# EAGLE design pihat-v1 (EAGLE 8.7.1)
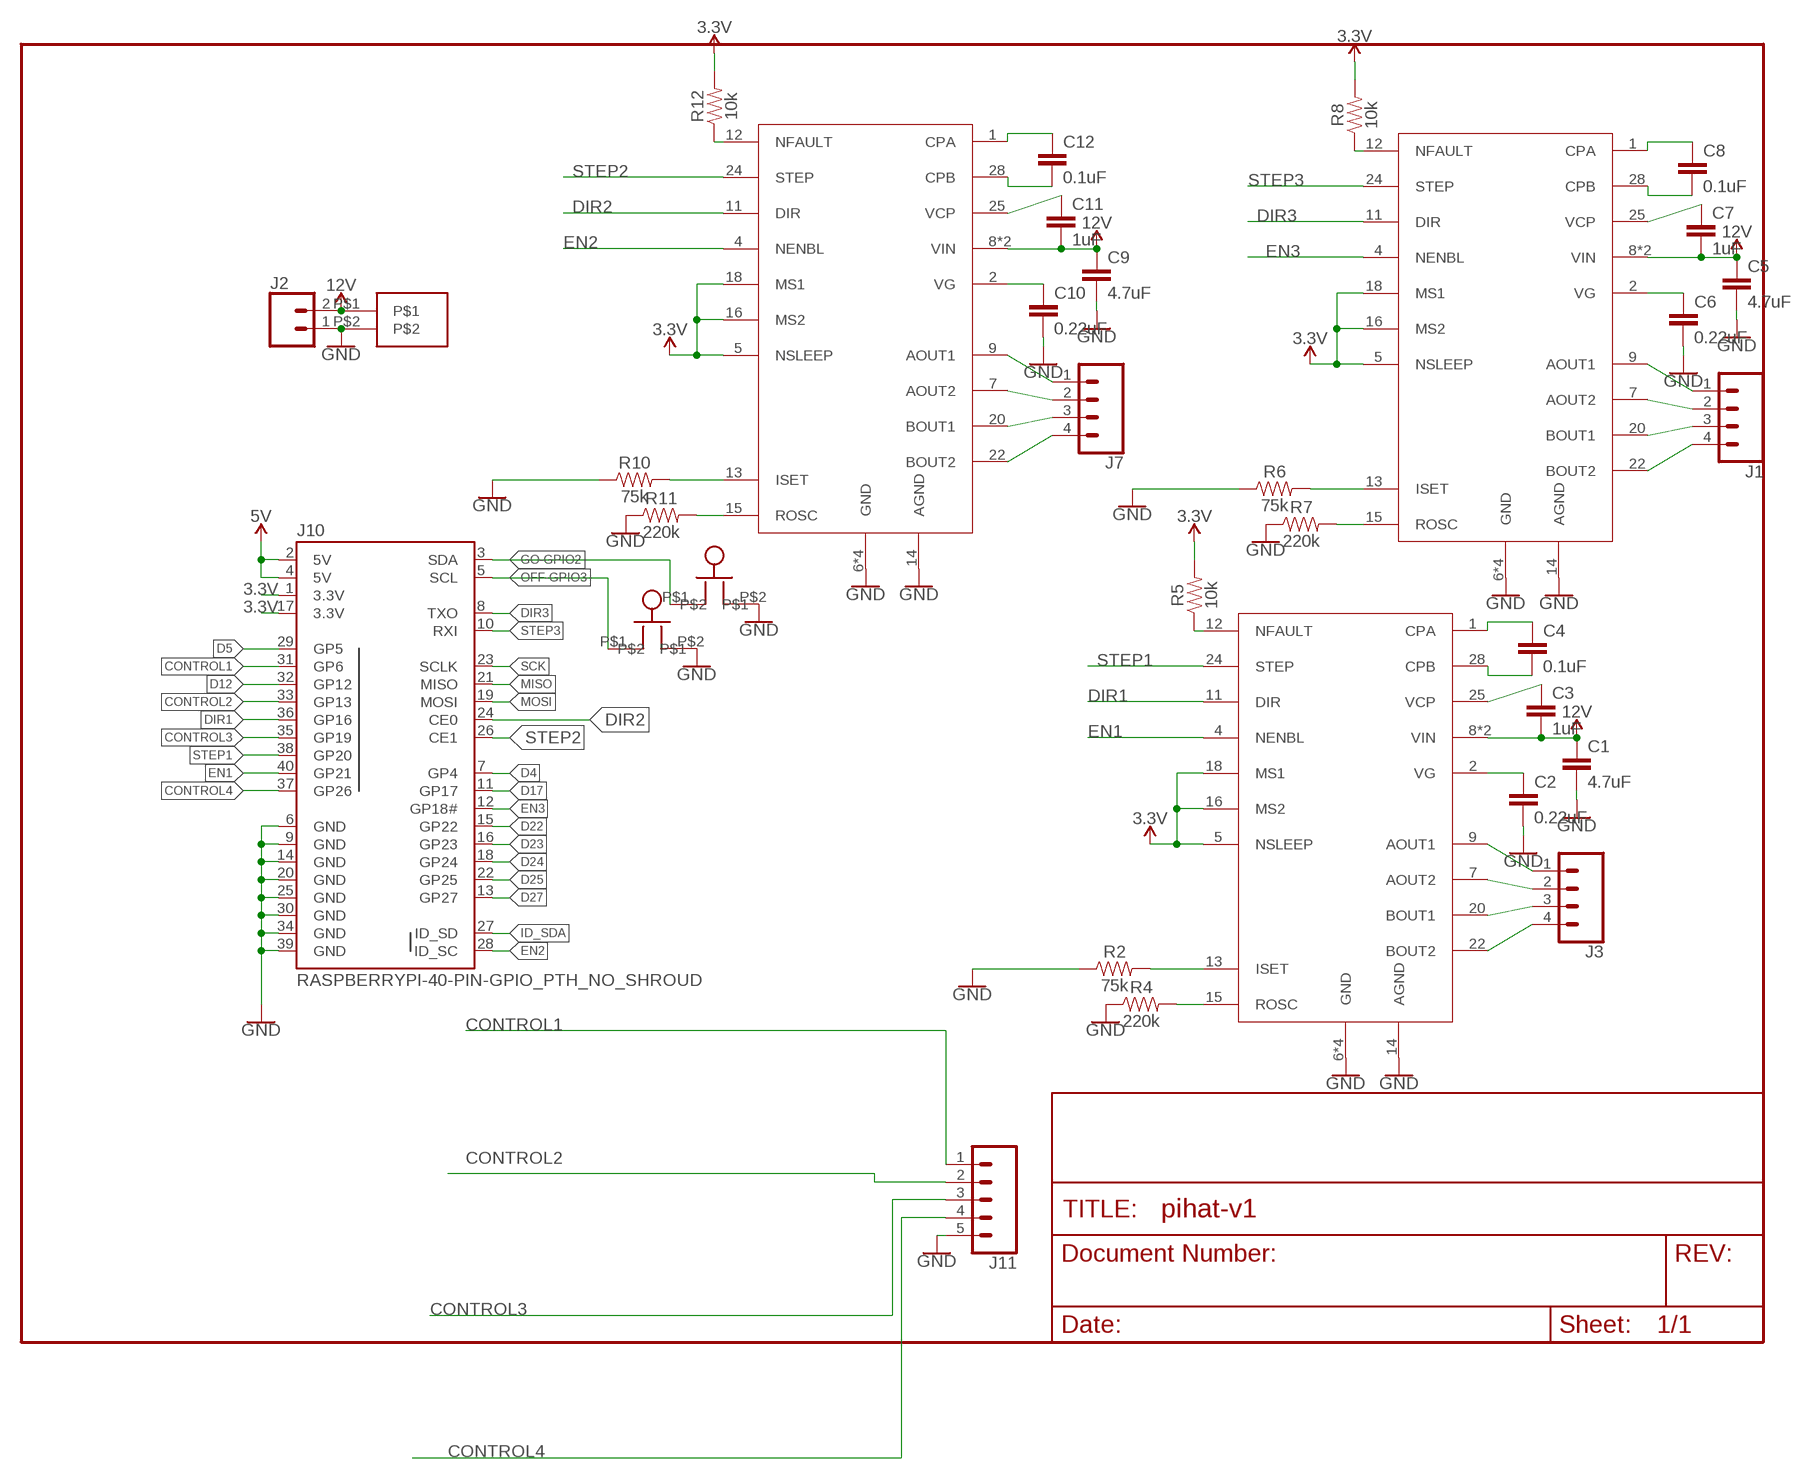
[diagram p0: schematic, sheet 1]

## Parts
C1  4.7uF  4.7UF-0603-6.3V-(10%)  [0603]
C2  0.22uF  4.7UF-0603-6.3V-(10%)  [0603]
C3  1uF  4.7UF-0603-6.3V-(10%)  [0603]
C4  0.1uF  4.7UF-0603-6.3V-(10%)  [0603]
C5  4.7uF  4.7UF-0603-6.3V-(10%)  [0603]
C6  0.22uF  4.7UF-0603-6.3V-(10%)  [0603]
C7  1uF  4.7UF-0603-6.3V-(10%)  [0603]
C8  0.1uF  4.7UF-0603-6.3V-(10%)  [0603]
C9  4.7uF  4.7UF-0603-6.3V-(10%)  [0603]
C10  0.22uF  4.7UF-0603-6.3V-(10%)  [0603]
C11  1uF  4.7UF-0603-6.3V-(10%)  [0603]
C12  0.1uF  4.7UF-0603-6.3V-(10%)  [0603]
J1  CONN_04  [1X04]
J2  CONN_02  [1X02]
J3  CONN_04  [1X04]
J7  CONN_04  [1X04]
J10  RASPBERRYPI-40-PIN-GPIO_PTH_NO_SHROUD  [2X20]
J11  CONN_05  [1X05]
R2  75k  10KOHM-0603-1/10W-1%  [0603]
R4  220k  10KOHM-0603-1/10W-1%  [0603]
R5  10k  10KOHM-0603-1/10W-1%  [0603]
R6  75k  10KOHM-0603-1/10W-1%  [0603]
R7  220k  10KOHM-0603-1/10W-1%  [0603]
R8  10k  10KOHM-0603-1/10W-1%  [0603]
R10  75k  10KOHM-0603-1/10W-1%  [0603]
R11  220k  10KOHM-0603-1/10W-1%  [0603]
R12  10k  10KOHM-0603-1/10W-1%  [0603]
U$1  MP6500MP6500  [TSSOP28]
U$2  MP6500MP6500  [TSSOP28]
U$3  MP6500MP6500  [TSSOP28]
U$4  BUTTON  [BUTTON]
U$5  BUTTON  [BUTTON]
U$6  SPRING-TERMINAL  [SPRING-TERMINAL]

## Nets
3.3V: J10.1(3.3V) J10.17(3.3V) R5.2 R8.2 R12.2 U$1.5(NSLEEP) U$1.16(MS2) U$1.18(MS1) U$2.5(NSLEEP) U$2.16(MS2) U$2.18(MS1) U$3.5(NSLEEP) U$3.16(MS2) U$3.18(MS1)
5V: J10.2(5V) J10.4(5V)
12V: C1.1 C3.2 C5.1 C7.2 C9.1 C11.2 J2.2 U$1.8(VIN) U$1.21(VIN) U$2.8(VIN) U$2.21(VIN) U$3.8(VIN) U$3.21(VIN) U$6.P$1
CONTROL1: J10.31(GP6) J11.1
CONTROL2: J10.33(GP13) J11.2
CONTROL3: J10.35(GP19) J11.3
CONTROL4: J10.37(GP26) J11.4
D4: J10.7(GP4)
D5: J10.29(GP5)
D12: J10.32(GP12)
D17: J10.11(GP17)
D22: J10.15(GP22)
D23: J10.16(GP23)
D24: J10.18(GP24)
D25: J10.22(GP25)
D27: J10.13(GP27)
DIR1: J10.36(GP16) U$3.11(DIR)
DIR2: J10.24(CE0) U$2.11(DIR)
DIR3: J10.8(TXO) U$1.11(DIR)
EN1: J10.40(GP21) U$3.4(NENBL)
EN2: J10.28(ID_SC) U$2.4(NENBL)
EN3: J10.12(GP18#) U$1.4(NENBL)
GND [vcc]: C1.2 C2.2 C5.2 C6.2 C9.2 C10.2 J2.1 J10.6(GND) J10.9(GND) J10.14(GND) J10.20(GND) J10.25(GND) J10.30(GND) J10.34(GND) J10.39(GND) J11.5 R2.1 R4.1 R6.1 R7.1 R10.1 R11.1 U$1.6(GND) U$1.10(GND) U$1.14(AGND) U$1.19(GND) U$1.23(GND) U$2.6(GND) U$2.10(GND) U$2.14(AGND) U$2.19(GND) U$2.23(GND) U$3.6(GND) U$3.10(GND) U$3.14(AGND) U$3.19(GND) U$3.23(GND) U$4.P$2 U$5.P$2 U$6.P$2
GO-GPIO2: J10.3(SDA) U$4.P$1
ID_SDA: J10.27(ID_SD)
MISO: J10.21(MISO)
MOSI: J10.19(MOSI)
N$5: J3.1 U$3.9(AOUT1)
N$6: J3.2 U$3.7(AOUT2)
N$7: J3.3 U$3.20(BOUT1)
N$8: J3.4 U$3.22(BOUT2)
N$9: J1.1 U$1.9(AOUT1)
N$10: J1.2 U$1.7(AOUT2)
N$11: J1.3 U$1.20(BOUT1)
N$12: J1.4 U$1.22(BOUT2)
N$13: C7.1 U$1.25(VCP)
N$14: C6.1 U$1.2(VG)
N$15: C8.1 U$1.1(CPA)
N$16: C8.2 U$1.28(CPB)
N$17: R5.1 U$3.12(NFAULT)
N$18: C3.1 U$3.25(VCP)
N$19: C2.1 U$3.2(VG)
N$22: C4.1 U$3.1(CPA)
N$23: C4.2 U$3.28(CPB)
N$24: R2.2 U$3.13(ISET)
N$25: R4.2 U$3.15(ROSC)
N$27: R7.2 U$1.15(ROSC)
N$28: R8.1 U$1.12(NFAULT)
N$29: R6.2 U$1.13(ISET)
N$32: J7.1 U$2.9(AOUT1)
N$33: J7.2 U$2.7(AOUT2)
N$39: J7.3 U$2.20(BOUT1)
N$40: J7.4 U$2.22(BOUT2)
N$41: C11.1 U$2.25(VCP)
N$42: C10.1 U$2.2(VG)
N$43: C12.1 U$2.1(CPA)
N$44: C12.2 U$2.28(CPB)
N$45: R11.2 U$2.15(ROSC)
N$46: R12.1 U$2.12(NFAULT)
N$47: R10.2 U$2.13(ISET)
OFF-GPIO3: J10.5(SCL) U$5.P$1
SCK: J10.23(SCLK)
STEP1: J10.38(GP20) U$3.24(STEP)
STEP2: J10.26(CE1) U$2.24(STEP)
STEP3: J10.10(RXI) U$1.24(STEP)

## Library data of the parts
C1 C5 C9 = SparkFun-Capacitors:4.7UF: 4.7µF ceramic capacitors A capacitor is a passive two-terminal electrical component used to store electrical energy temporarily in an electric field.; PROD_ID: CAP-08280
C2-C4 C6-C8 C10-C12 = SparkFun-Capacitors:4.7UF: 4.7µF ceramic capacitors A capacitor is a passive two-terminal electrical component used to store electrical energy temporarily in an electric field.; PROD_ID: CAP-08280; VALUE: 4.7uF
J1 J3 J7 = SparkFun-Connectors:CONN_04: Multi connection point. Often used as Generic Header-pin footprint for 0.1 inch spaced/style header connections On any of the 0.1 inch spaced packages, you can populate with these: Break Away Headers - Straight <https://www.sparkfun.com/products/116> (PRT-00116) Break Away Male Headers - Right Angle <https://www.sparkfun.com/products/553> (PRT-00553) Female Headers <https://www.sparkfun.com/products/115> (PRT-00115) Break Away Headers - Machine Pin <https://www.sparkfun.com/products/117> (PRT-00117) Break Away Female Headers - Swiss Machine Pin <https://www.sparkfun.com/products/743> (PRT-00743) For SCREWTERMINALS and SPRING TERMINALS visit here: Screw Terimnals on SparkFun.com <https://www.sparkfun.com/search/results?term=Screw+Terminals> (5mm/3.5mm/2.54mm spacing) This device is also useful as a general connection point to wire up your design to another part of your project. Our various solder wires solder well into these plated through hole pads. Hook-Up Wire - Assortment (Stranded, 22 AWG) <https://www.sparkfun.com/products/11375> (PRT-11375) Hook-Up Wire - Assortment (Solid Core, 22 AWG) <https://www.sparkfun.com/products/11367> (PRT-11367) View the entire wire category on our website here <https://www.sparkfun.com/categories/141> Special notes: Molex polarized connector foot print use with SKU : PRT-08231 with associated crimp pins and housings. 1MM SMD Version SKU: PRT-10208; PROD_ID: CONN-09696
J2 = SparkFun-Connectors:CONN_02: Multi connection point. Often used as Generic Header-pin footprint for 0.1 inch spaced/style header connections On any of the 0.1 inch spaced packages, you can populate with these: Break Away Headers - Straight <https://www.sparkfun.com/products/116> (PRT-00116) Break Away Male Headers - Right Angle <https://www.sparkfun.com/products/553> (PRT-00553) Female Headers <https://www.sparkfun.com/products/115> (PRT-00115) Break Away Headers - Machine Pin <https://www.sparkfun.com/products/117> (PRT-00117) Break Away Female Headers - Swiss Machine Pin <https://www.sparkfun.com/products/743> (PRT-00743) For SCREWTERMINALS and SPRING TERMINALS visit here: Screw Terimnals on SparkFun.com <https://www.sparkfun.com/search/results?term=Screw+Terminals> (5mm/3.5mm/2.54mm spacing) This device is also useful as a general connection point to wire up your design to another part of your project. Our various solder wires solder well into these plated through hole pads. Hook-Up Wire - Assortment (Stranded, 22 AWG) <https://www.sparkfun.com/products/11375> (PRT-11375) Hook-Up Wire - Assortment (Solid Core, 22 AWG) <https://www.sparkfun.com/products/11367> (PRT-11367) View the entire wire category on our website here <https://www.sparkfun.com/categories/141> Special notes: Molex polarized connector foot print use with: PRT-08233 with associated crimp pins and housings. 2.54_SCREWTERM for use with PRT-10571. 3.5mm Screw Terminal footprints for PRT-08084 5mm Screw Terminal footprints for use with PRT-08432
J10 = SparkFun-Connectors:RASPBERRYPI-40-PIN-GPIO: Raspberry Pi GPIO Header 2x20 pin connector, as found on B, B+, A+ models. Both shrouded PTH and SMT versions available. SparkFun Products: GPIO Shrouded Header <https://www.sparkfun.com/products/13054>- PTH SparkFun Pi Wedge (Preassembled) <https://www.sparkfun.com/products/13717>
J11 = SparkFun-Connectors:CONN_05: Multi connection point. Often used as Generic Header-pin footprint for 0.1 inch spaced/style header connections On any of the 0.1 inch spaced packages, you can populate with these: Break Away Headers - Straight <https://www.sparkfun.com/products/116> (PRT-00116) Break Away Male Headers - Right Angle <https://www.sparkfun.com/products/553> (PRT-00553) Female Headers <https://www.sparkfun.com/products/115> (PRT-00115) Break Away Headers - Machine Pin <https://www.sparkfun.com/products/117> (PRT-00117) Break Away Female Headers - Swiss Machine Pin <https://www.sparkfun.com/products/743> (PRT-00743) For SCREWTERMINALS and SPRING TERMINALS visit here: Screw Terimnals on SparkFun.com <https://www.sparkfun.com/search/results?term=Screw+Terminals> (5mm/3.5mm/2.54mm spacing) This device is also useful as a general connection point to wire up your design to another part of your project. Our various solder wires solder well into these plated through hole pads. Hook-Up Wire - Assortment (Stranded, 22 AWG) <https://www.sparkfun.com/products/11375> (PRT-11375) Hook-Up Wire - Assortment (Solid Core, 22 AWG) <https://www.sparkfun.com/products/11367> (PRT-11367) View the entire wire category on our website here <https://www.sparkfun.com/categories/141> Special notes: Molex polarized connector foot print use with SKU : PRT-08231 with associated crimp pins and housings. 1MM SMD Version SKU: PRT-10208
R2 R4 R6 R7 R10 R11 = SparkFun-Resistors:10KOHM: 10kΩ resistor A resistor is a passive two-terminal electrical component that implements electrical resistance as a circuit element. Resistors act to reduce current flow, and, at the same time, act to lower voltage levels within circuits. - Wikipedia; PROD_ID: RES-00824; VALUE: 10k
R5 R8 R12 = SparkFun-Resistors:10KOHM: 10kΩ resistor A resistor is a passive two-terminal electrical component that implements electrical resistance as a circuit element. Resistors act to reduce current flow, and, at the same time, act to lower voltage levels within circuits. - Wikipedia; PROD_ID: RES-00824
U$1-U$3 = spietz-library-2:MP6500
U$4 U$5 = spietz-library-2:BUTTON
U$6 = spietz-library-2:SPRING-TERMINAL

## Net classes
0 Default: width 0.178 mm
1 vcc: width 0.178 mm

## Board
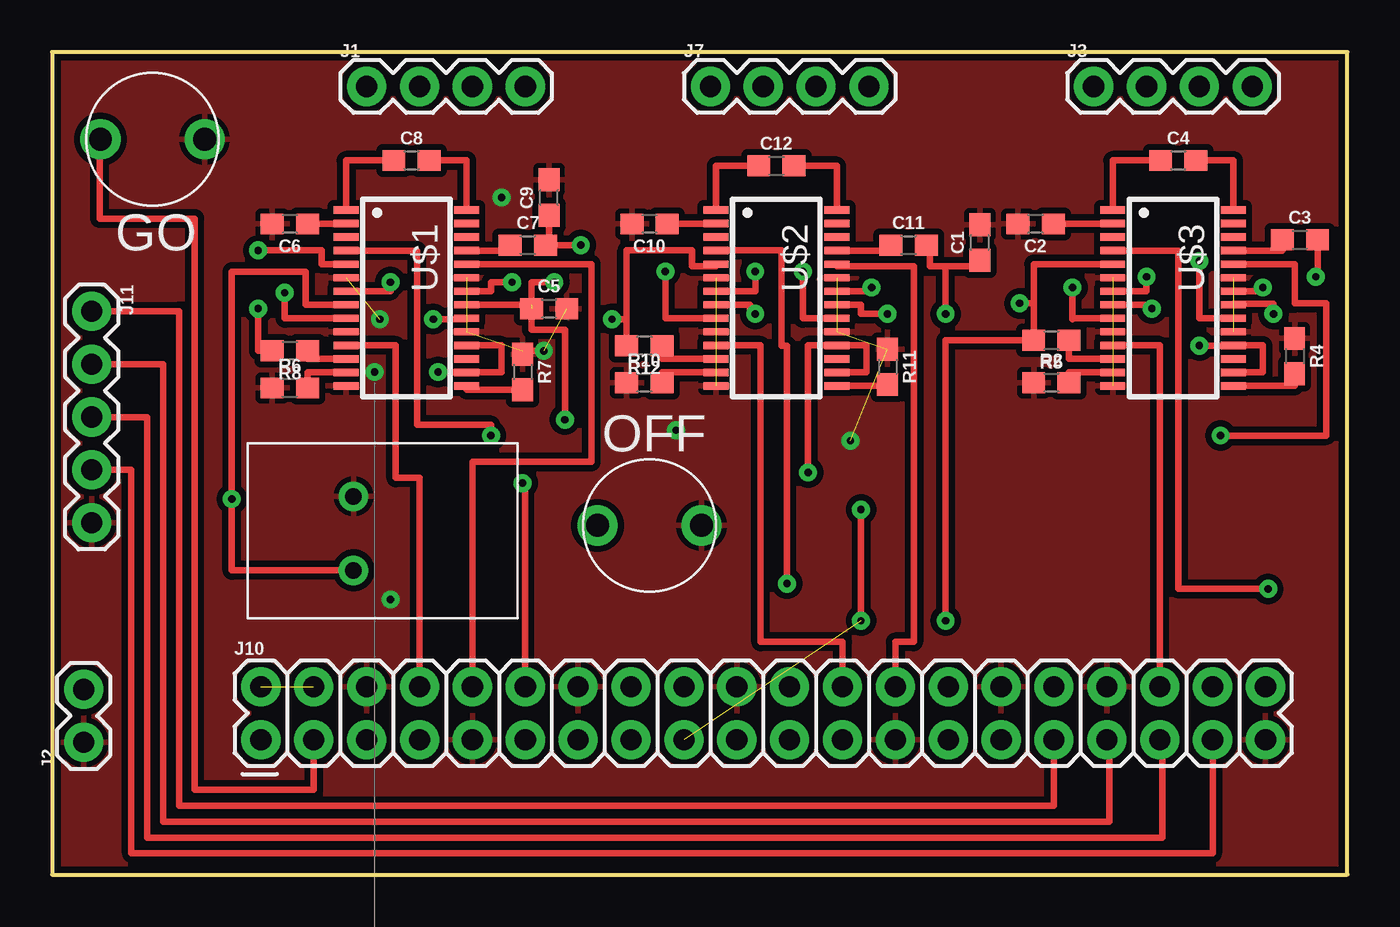
[diagram p1: board, top side]
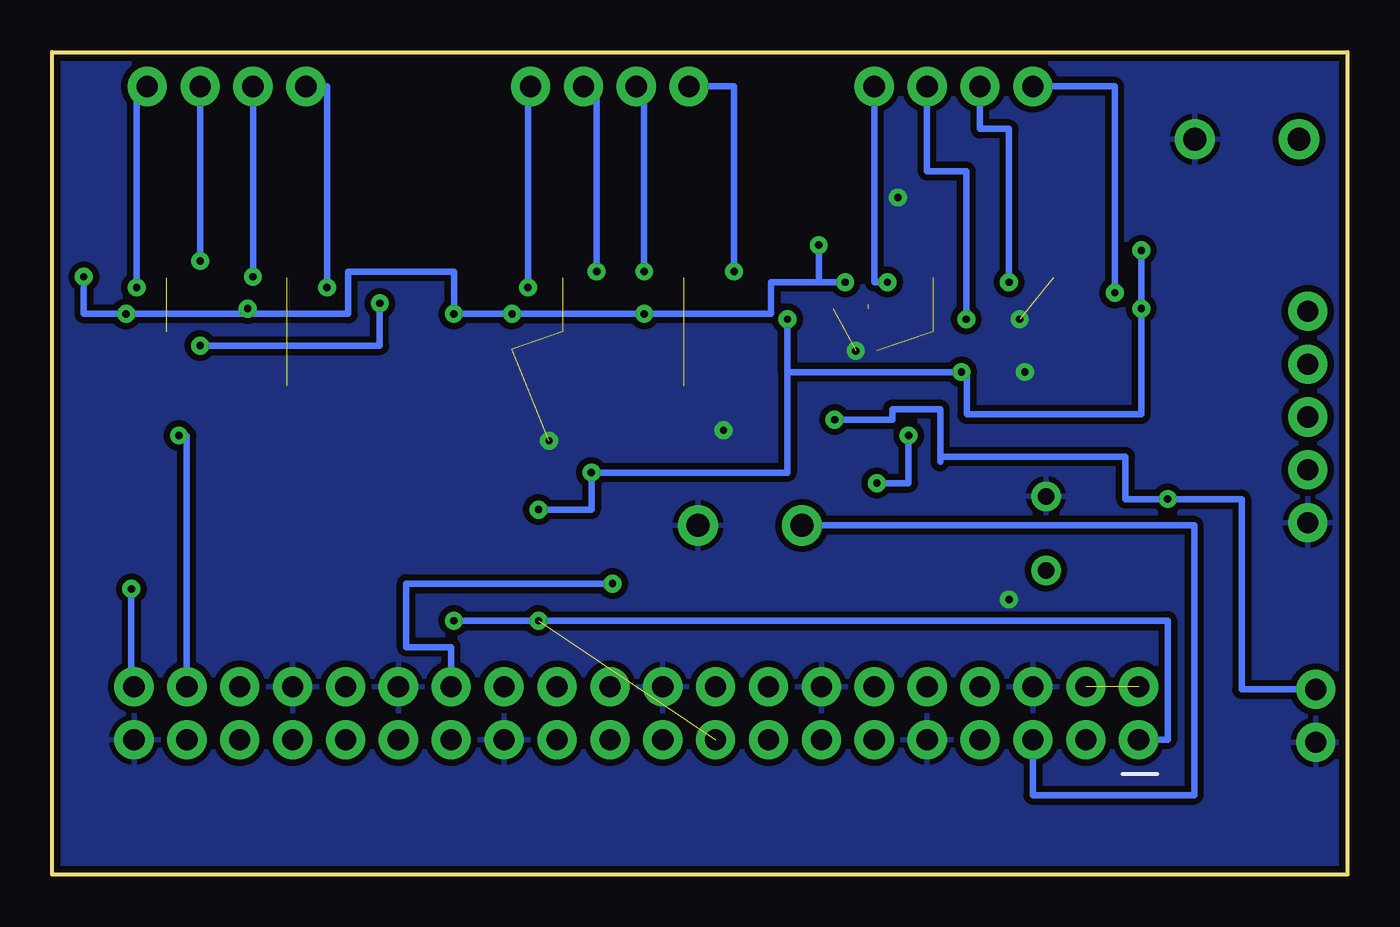
[diagram p2: board, bottom side, seen from below]

Size 62.23 x 39.5 mm. Coordinates in mm from the lower left corner, seen from the top.
Outline: 0,39.5 0,0 62.23,0 62.23,39.5 0,39.5
Copper layers (1*16): Top 0.035mm / dielectric 1.5mm / Bottom 0.035mm
Design rules "default": minimum track width 8mil, minimum drill 20mil, track to track 8mil, track to pad 8mil, pad to pad 8mil, via to via 8mil, smd to smd 8mil, copper to edge 10mil, drill to drill 8mil, minimum pad ring 12mil, minimum via ring 10mil, stop-mask expansion 4mil, vias tented up to drill 25mil, thermal gap 10mil

### Footprints (pad centres in the part's own frame; a part is rotated, then mirrored left to right if it is on the bottom)
0603 = smd 1.1 x 1: 1 -0.85,0; 2 0.85,0
1X04 = drill 1.016 pad 1.88: 1 0,0; 2 2.54,0; 3 5.08,0; 4 7.62,0
1X02 = drill 1.016 pad 1.88: 1 0,0; 2 2.54,0
2X20 = drill 1.016 pad 1.88: 1 0,0; 2 0,2.54; 3 2.54,0; 4 2.54,2.54; 5 5.08,0; 6 5.08,2.54; 7 7.62,0; 8 7.62,2.54; 9 10.16,0; 10 10.16,2.54; 11 12.7,0; 12 12.7,2.54; 13 15.24,0; 14 15.24,2.54; 15 17.78,0; 16 17.78,2.54; 17 20.32,0; 18 20.32,2.54; 19 22.86,0; 20 22.86,2.54; 21 25.4,0; 22 25.4,2.54; 23 27.94,0; 24 27.94,2.54; 25 30.48,0; 26 30.48,2.54; 27 33.02,0; 28 33.02,2.54; 29 35.56,0; 30 35.56,2.54; 31 38.1,0; 32 38.1,2.54; 33 40.64,0; 34 40.64,2.54; 35 43.18,0; 36 43.18,2.54; 37 45.72,0; 38 45.72,2.54; 39 48.26,0; 40 48.26,2.54
1X05 = drill 1.016 pad 1.88: 1 0,0; 2 2.54,0; 3 5.08,0; 4 7.62,0; 5 10.16,0
TSSOP28 = smd 0.35 x 1.2: 1 -4.225,-2.9; 2 -3.575,-2.9; 3 -2.925,-2.9; 4 -2.275,-2.9; 5 -1.625,-2.9; 6 -0.975,-2.9; 7 -0.325,-2.9; 8 0.325,-2.9; 9 0.975,-2.9; 10 1.625,-2.9; 11 2.275,-2.9; 12 2.925,-2.9; 13 3.575,-2.9; 14 4.225,-2.9; 15 4.225,2.9; 16 3.575,2.9; 17 2.925,2.9; 18 2.275,2.9; 19 1.625,2.9; 20 0.975,2.9; 21 0.325,2.9; 22 -0.325,2.9; 23 -0.975,2.9; 24 -1.625,2.9; 25 -2.275,2.9; 26 -2.925,2.9; 27 -3.575,2.9; 28 -4.225,2.9
BUTTON = drill 1.1 pad 1.93: P$1 -2.499,0; P$2 2.499,0
SPRING-TERMINAL = drill 0.8: P$1 5.08,1.778; P$2 5.08,5.334

### Placement (x,y rotation side)
C1  44.58,30.35 90 top
C2  47.24,31.24 180 top
C3  59.94,30.48 0 top
C4  54.1,34.29 0 top
C5  23.88,27.18 0 top
C6  11.43,31.24 180 top
C7  22.86,30.23 0 top
C8  17.27,34.29 0 top
C9  23.88,32.51 90 top
C10  28.7,31.24 180 top
C11  41.15,30.23 0 top
C12  34.8,34.04 0 top
J1  15.11,37.85 0 top
J2  1.52,6.35 90 top
J3  50.04,37.85 0 top
J7  31.62,37.85 0 top
J10  10.03,6.48 0 top
J11  1.91,27.05 270 top
R2  48.01,23.62 0 top
R4  59.69,24.89 270 top
R5  48.01,25.65 180 top
R6  11.43,23.37 0 top
R7  22.61,24.13 270 top
R8  11.43,25.15 180 top
R10  28.45,23.62 0 top
R11  40.13,24.38 270 top
R12  28.45,25.4 180 top
U$1  17.02,27.69 270 top
U$2  34.8,27.69 270 top
U$3  53.85,27.69 270 top
U$4  4.83,35.31 0 top
U$5  28.7,16.76 0 top
U$6  9.4,12.83 0 top

### Tracks (layer width: path | path; a pad name or v marks a point on that pad's centre or on a via)
3.3V  (via drill 0.35)  (1 unrouted)
  Top 0.305: U$3.16 58.17,24.11 58.17,25.41 U$3.18 56.75,25.4 v55.12,25.4 | U$3.5 47.16,29.31 47.16,27.43 | 47.16,27.43 R5.2 42.93,25.65 v42.93,12.19 | v46.48,27.43 47.16,27.43 | U$2.16 39.12,24.11 39.12,25.41 U$2.18 36.32,25.41 v36.32,19.3 | U$1.18 21.59,25.41 21.59,24.11 U$1.16 19.92,24.13 v18.54,24.13 | v38.86,17.53 v38.86,12.19 | U$2.5 31.9,29.21 30.73,29.21 30.73,29.97 27.6,29.97 R12.2 27.6,26.67 v26.9,26.67 | v9.91,27.18 9.91,25.15 R8.2 | U$1.5 12.95,29.31 12.95,29.97 v9.91,29.97
  Bottom 0.305: v55.12,25.4 46.48,25.4 v46.48,27.43 | v42.93,12.19 v38.86,12.19 8.64,12.19 8.64,6.48 J10.1 | v38.86,17.53 36.32,17.53 v36.32,19.3 26.9,19.3 v26.9,26.67 26.9,24.13 v18.54,24.13 18.29,24.13 18.29,22.1 9.91,22.1 v9.91,27.18 v9.91,29.97
5V  (1 unrouted)
12V  (via drill 0.35)  (1 unrouted)
  Top 0.305: C11.2 42.16,30.23 42.16,29.21 42.93,29.21 | 42.93,29.21 44.58,29.21 C1.1 | U$6.P$1 8.64,14.61 v8.64,18.03 8.64,28.96 12.19,28.96 12.19,27.36 U$1.8 | U$1.21 23.03,27.36 | C9.1 23.88,30.23 | 23.88,30.23 C7.2 | 23.03,27.36 23.03,28.45 v24.13,28.45 | v25.4,30.23 23.88,30.23 | v33.78,26.92 33.53,26.92 33.53,27.36 U$2.8 | U$2.21 38.86,27.36 38.86,26.92 v40.13,26.92 | v42.93,26.92 42.93,29.21 | U$3.8 52.83,27.36 v52.83,27.18 | v58.67,26.92 58.67,27.41 56.75,27.41 U$3.21 | C3.2 60.79,28.7 v60.71,28.7 | 23.03,27.36 23.03,26.16 24.64,26.16 v24.64,21.84
  Bottom 0.305: J2.2 5.08,8.89 5.08,18.03 v8.64,18.03 10.67,18.03 10.67,20.07 19.56,20.07 | v24.13,28.45 25.4,28.45 | 25.4,28.45 v25.4,30.23 | 25.4,28.45 27.69,28.45 27.69,26.92 v33.78,26.92 v40.13,26.92 v42.93,26.92 42.93,28.96 48.01,28.96 48.01,26.92 52.83,26.92 | v52.83,27.18 52.83,26.92 | 52.83,26.92 v58.67,26.92 60.71,26.92 v60.71,28.7 | 19.56,20.07 19.56,19.81 | 19.56,20.07 19.56,22.35 21.87,22.35 21.87,21.84 v24.64,21.84
CONTROL1
  Top 0.305: J11.1 6.1,27.05 6.1,3.3 48.13,3.3 J10.31
CONTROL2
  Top 0.305: J11.2 5.33,24.51 5.33,2.54 50.8,2.54 50.8,6.48 J10.33
CONTROL3
  Top 0.305: J11.3 4.57,21.97 4.57,1.78 53.34,1.78 53.34,6.48 J10.35
CONTROL4
  Top 0.305: J10.37 55.75,1.02 3.81,1.02 3.81,19.43 J11.4
DIR1
  Top 0.305: J10.36 53.21,25.41 U$3.11
DIR2
  Top 0.305: J10.24 37.97,11.18 34.04,11.18 34.04,25.41 U$2.11
DIR3
  Top 0.305: J10.8 17.65,19.05 16.51,19.05 16.51,25.41 U$1.11
EN1  (via drill 0.35)
  Top 0.305: U$3.4 54.1,29.96 54.1,13.72 v58.42,13.72
  Bottom 0.305: v58.42,13.72 58.42,9.02 J10.40
EN2  (via drill 0.35)
  Top 0.305: v35.31,13.97 35.31,25.4 35.05,25.4 35.05,29.97 U$2.4
  Bottom 0.305: J10.28 43.05,10.92 45.21,10.92 45.21,13.97 v35.31,13.97
EN3  (via drill 0.35)
  Top 0.305: J10.12 22.73,18.8 v22.61,18.8 | v21.08,21.08 21.08,21.59 17.53,21.59 17.53,29.96 U$1.4
  Bottom 0.305: v22.61,18.8 21.08,18.8 v21.08,21.08
GND  (via drill 0.35)  (12 unrouted)
  Top 0.305: R7.1 22.61,25.15 v23.62,25.15
  other vias: 29.97,21.34 21.59,32.51 15.75,26.67 15.49,24.13 16.26,13.21 38.35,20.83
  pour Top (isolate 0.305): 0,40.26 65.91,40.26 65.79,-6.1 0,-6.1
  pour Bottom (isolate 0.305): -1.02,39.88 65.66,39.88 65.79,-6.1 -1.14,-6.1
GO-GPIO2
  Top 0.305: J10.3 12.57,4.06 6.86,4.06 6.86,31.5 2.29,31.5 2.29,35.31 U$4.P$1
N$5  (via drill 0.35)
  Top 0.305: U$3.9 49.02,26.71 | 49.02,26.71 49.02,26.67 | 49.02,26.71 v49.02,28.19
  Bottom 0.305: v49.02,28.19 49.02,37.85 J3.1
N$6  (via drill 0.35)
  Top 0.305: U$3.7 52.58,28.01 v52.58,28.7
  Bottom 0.305: v52.58,28.7 J3.2
N$7  (via drill 0.35)
  Top 0.305: U$3.20 55.12,26.71 v55.12,29.46
  Bottom 0.305: v55.12,29.46 J3.3
N$8  (via drill 0.35)
  Top 0.305: U$3.22 58.17,28.01 v58.17,28.19
  Bottom 0.305: v58.17,28.19 58.17,37.85 J3.4
N$9  (via drill 0.35)
  Top 0.305: U$1.9 11.18,26.71 v11.18,27.94
  Bottom 0.305: v11.18,27.94 11.18,37.85 J1.1
N$10  (via drill 0.35)
  Top 0.305: U$1.7 16.26,28.01 v16.26,28.45
  Bottom 0.305: v16.26,28.45 16.26,35.81 17.65,35.81 J1.2
N$11  (via drill 0.35)
  Top 0.305: U$1.20 19.92,26.67 v18.31,26.67
  Bottom 0.305: v18.31,26.67 18.31,33.78 20.19,33.78 J1.3
N$12  (via drill 0.35)
  Top 0.305: U$1.22 21.08,28.01 21.08,28.45 v22.1,28.45
  Bottom 0.305: v22.1,28.45 22.73,28.45 J1.4
N$13
  Top 0.305: U$1.25 22.01,29.96 C7.1
N$14
  Top 0.305: U$1.2 14.12,31.24 C6.1
N$15
  Top 0.305: C8.1 14.12,34.29 U$1.1
N$16
  Top 0.305: C8.2 19.92,34.29 U$1.28
N$17
  Top 0.305: U$3.12 48.86,24.76 R5.1
N$18
  Top 0.305: U$3.25 59.09,29.96 C3.1
N$19
  Top 0.305: U$3.2 50.95,31.24 C2.1
N$22
  Top 0.305: C4.1 50.95,34.29 U$3.1
N$23
  Top 0.305: C4.2 56.75,34.29 U$3.28
N$24
  Top 0.305: U$3.13 48.86,24.11 R2.2
N$25
  Top 0.305: U$3.15 59.69,23.46 R4.2
N$27
  Top 0.305: U$1.15 19.92,23.28 R7.2
N$28
  Top 0.305: U$1.12 12.28,24.76 R8.1
N$29
  Top 0.305: U$1.13 12.28,24.11 R6.2
N$32  (via drill 0.35)
  Top 0.305: U$2.9 29.46,26.71 v29.46,28.96
  Bottom 0.305: v29.46,28.96 29.46,37.85 J7.1
N$33  (via drill 0.35)
  Top 0.305: U$2.7 33.78,28.01 v33.78,28.96
  Bottom 0.305: v33.78,28.96 33.78,37.85 J7.2
N$39  (via drill 0.35)
  Top 0.305: U$2.20 36.07,26.71 v36.07,28.96
  Bottom 0.305: v36.07,28.96 36.07,37.85 J7.3
N$40  (via drill 0.35)
  Top 0.305: U$2.22 39.37,28.01 v39.37,28.19
  Bottom 0.305: v39.37,28.19 39.37,37.85 J7.4
N$41
  Top 0.305: U$2.25 40.3,29.96 C11.1
N$42
  Top 0.305: U$2.2 29.55,31.26 C10.1
N$43
  Top 0.305: C12.1 31.9,34.04 U$2.1
N$44
  Top 0.305: U$2.28 37.7,34.04 C12.2
N$45
  Top 0.305: U$2.15 40.13,23.46 R11.2
N$46
  Top 0.305: U$2.12 29.3,24.76 R12.1
N$47
  Top 0.305: U$2.13 29.3,24.11 R10.2
OFF-GPIO3
  Bottom 0.305: J10.5 15.11,3.81 7.37,3.81 7.37,16.76 U$5.P$1
STEP1  (via drill 0.35)
  Top 0.305: U$3.24 59.69,29.31 59.69,27.43 61.21,27.43 61.21,21.08 v56.13,21.08 | 55.88,9.02 J10.38
  Bottom 0.305: J10.38 55.75,21.08 v56.13,21.08
STEP2
  Top 0.305: U$2.24 37.7,29.21 41.4,29.21 41.4,11.18 40.51,11.18 J10.26
STEP3
  Top 0.305: J10.10 20.19,19.81 25.91,19.81 25.91,29.31 U$1.24

### Text on the board
tPlace: GO | OFF
tValues: Tent Vias! | Arduino Wee v1.3